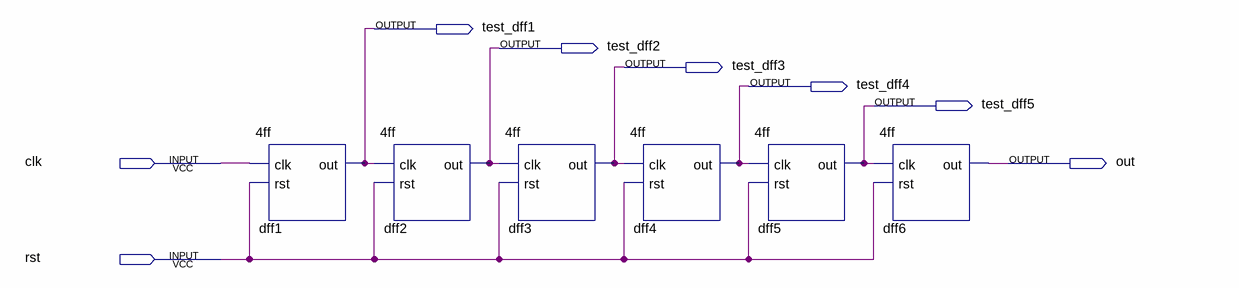
[diagram p0: schematic sheet]
// Quartus schematic lab05.bdf as structural Verilog: 6 symbols, 8 pins
module lab05 (
  input  clk,
  input  rst,
  output test_dff1,
  output test_dff2,
  output test_dff3,
  output test_dff4,
  output test_dff5,
  output out
);

  \4ff  dff1 (.clk(clk), .rst(rst), .out(test_dff1));
  \4ff  dff2 (.clk(test_dff1), .rst(rst), .out(test_dff2));
  \4ff  dff3 (.clk(test_dff2), .rst(rst), .out(test_dff3));
  \4ff  dff4 (.clk(test_dff3), .rst(rst), .out(test_dff4));
  \4ff  dff5 (.clk(test_dff4), .rst(rst), .out(test_dff5));
  \4ff  dff6 (.clk(test_dff5), .rst(rst), .out(out));
endmodule
